# EAGLE schematic rotaryboard-small (EAGLE 6.5.0)
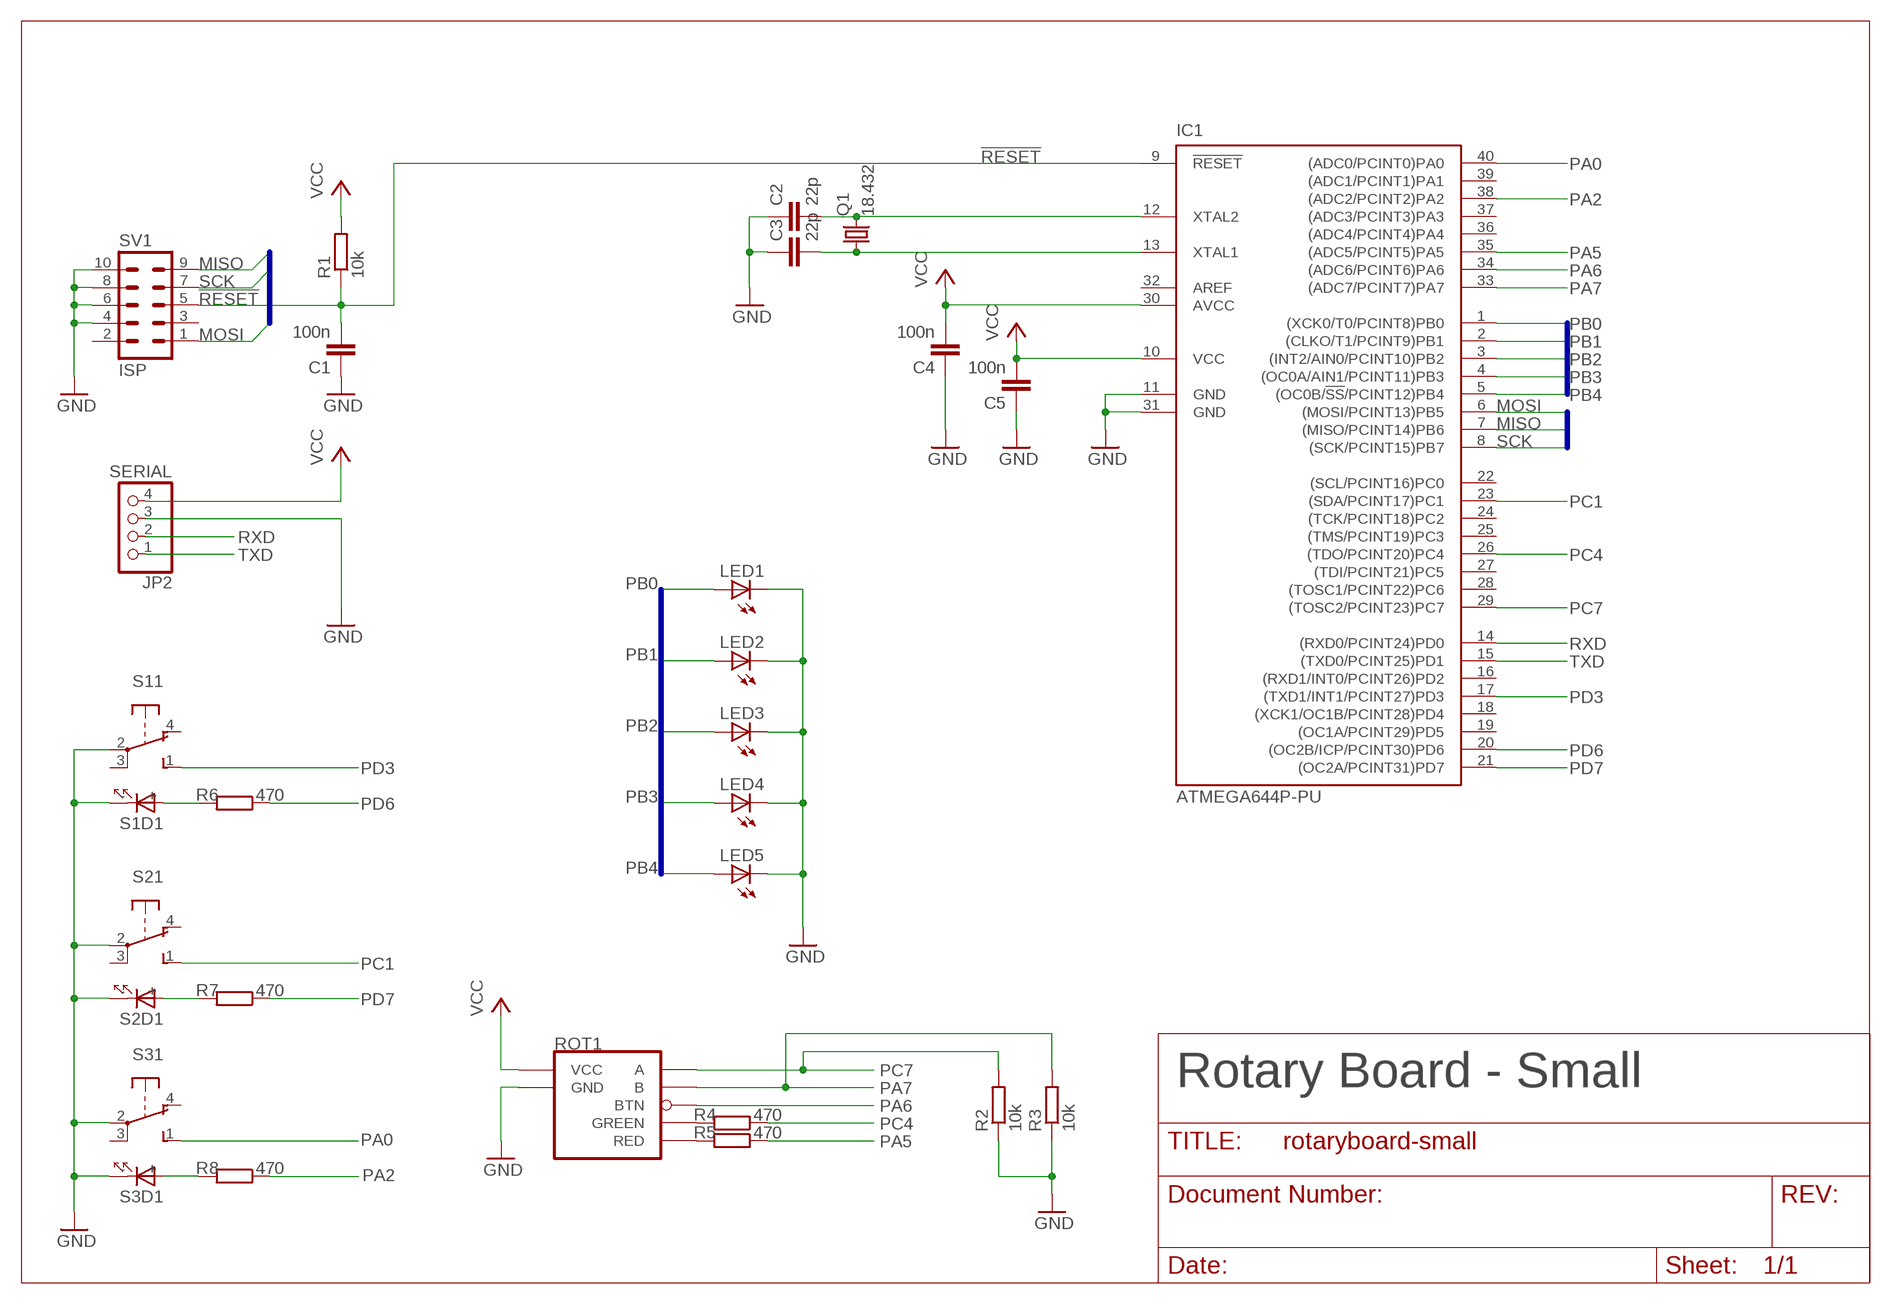
[diagram p0: schematic, sheet 1]

## Parts
C1  100n  C-EU050-025X075  [C050-025X075]
C2  22p  C-EU050-025X075  [C050-025X075]
C3  22p  C-EU050-025X075  [C050-025X075]
C4  100n  C-EU050-025X075  [C050-025X075]
C5  100n  C-EU050-025X075  [C050-025X075]
IC1  ATMEGA644P-PU  MEGA164P/324P/644P-PU  [DIL40]
JP2  SERIAL  PINHD-1X4  [1X04]
LED1  LED3MM  [LED3MM]
LED2  LED3MM  [LED3MM]
LED3  LED3MM  [LED3MM]
LED4  LED3MM  [LED3MM]
LED5  LED3MM  [LED3MM]
Q1  18.432  CRYSTALHC18U-V  [HC18U-V]
R1  10k  R-EU_0207/10  [0207/10]
R2  10k  R-EU_0207/10  [0207/10]
R3  10k  R-EU_0207/10  [0207/10]
R4  470  R-EU_0207/10  [0207/10]
R5  470  R-EU_0207/10  [0207/10]
R6  470  R-EU_0207/10  [0207/10]
R7  470  R-EU_0207/10  [0207/10]
R8  470  R-EU_0207/10  [0207/10]
ROT1  DPL12SVCUSTOM  [DPL12SV]
S1  SRKL  [SRKL]
S2  SRKL  [SRKL]
S3  SRKL  [SRKL]
SV1  ISP  ML10  [ML10]

## Nets
!RESET: C1.2 IC1.9(!RESET) R1.1 SV1.5
GND: C1.1 C2.1 C3.1 C4.1 C5.1 IC1.11(GND) IC1.31(GND) JP2.3 LED1.K(C) LED2.K(C) LED3.K(C) LED4.K(C) LED5.K(C) R2.1 R3.1 ROT1.GND S1.2(1:P) S1.-(D1:C) S2.2(1:P) S2.-(D1:C) S3.2(1:P) S3.-(D1:C) SV1.4 SV1.6 SV1.8 SV1.10
MISO: IC1.7((MISO/PCINT14)PB6) SV1.9
MOSI: IC1.6((MOSI/PCINT13)PB5) SV1.1
N$1: C3.2 IC1.13(XTAL1) Q1.1
N$2: C2.2 IC1.12(XTAL2) Q1.2
N$3: R8.2 S3.+(D1:A)
N$11: R4.2 ROT1.GREEN
N$12: R5.2 ROT1.RED
N$13: R7.2 S2.+(D1:A)
N$14: R6.2 S1.+(D1:A)
PA0: IC1.40((ADC0/PCINT0)PA0) S3.1(1:S)
PA2: IC1.38((ADC2/PCINT2)PA2) R8.1
PA5: IC1.35((ADC5/PCINT5)PA5) R5.1
PA6: IC1.34((ADC6/PCINT6)PA6) ROT1.BTN
PA7: IC1.33((ADC7/PCINT7)PA7) R3.2 ROT1.B
PB0: IC1.1((XCK0/T0/PCINT8)PB0) LED1.A
PB1: IC1.2((CLKO/T1/PCINT9)PB1) LED2.A
PB2: IC1.3((INT2/AIN0/PCINT10)PB2) LED3.A
PB3: IC1.4((OC0A/AIN1/PCINT11)PB3) LED4.A
PB4: IC1.5((OC0B/!SS!/PCINT12)PB4) LED5.A
PC1: IC1.23((SDA/PCINT17)PC1) S2.1(1:S)
PC4: IC1.26((TDO/PCINT20)PC4) R4.1
PC7: IC1.29((TOSC2/PCINT23)PC7) R2.2 ROT1.A
PD3: IC1.17((TXD1/INT1/PCINT27)PD3) S1.1(1:S)
PD6: IC1.20((OC2B/ICP/PCINT30)PD6) R6.1
PD7: IC1.21((OC2A/PCINT31)PD7) R7.1
RXD: IC1.14((RXD0/PCINT24)PD0) JP2.2
SCK: IC1.8((SCK/PCINT15)PB7) SV1.7
TXD: IC1.15((TXD0/PCINT25)PD1) JP2.1
VCC: C4.2 C5.2 IC1.10(VCC) IC1.30(AVCC) JP2.4 R1.2 ROT1.VCC
Unconnected: IC1.16((RXD1/INT0/PCINT26)PD2) IC1.18((XCK1/OC1B/PCINT28)PD4) IC1.19((OC1A/PCINT29)PD5) IC1.22((SCL/PCINT16)PC0) IC1.24((TCK/PCINT18)PC2) IC1.25((TMS/PCINT19)PC3) IC1.27((TDI/PCINT21)PC5) IC1.28((TOSC1/PCINT22)PC6) IC1.36((ADC4/PCINT4)PA4) IC1.37((ADC3/PCINT3)PA3) IC1.39((ADC1/PCINT1)PA1) S1.3(1:P) S1.4(1:O) S2.3(1:P) S2.4(1:O) S3.3(1:P) S3.4(1:O) SV1.2 SV1.3

## Buses
PROG:MOSI,MISO,SCK
LEDS:PB[0..4]

## Notes on the sheet
- Rotary Board - Small

## Power pins joined to a net without a drawn wire
AREF: IC1.32(AREF)

## Library data of the parts
C1-C5 = rcl:C-EU: CAPACITOR, European symbol
IC1 = avr-5:MEGA164P/324P/644P-PU
JP2 = pinhead:PINHD-1X4: PIN HEADER
LED1-LED5 = led:LED: LED OSRAM: - CHIPLED LG R971, LG N971, LY N971, LG Q971, LY Q971, LO R971, LY R971 LH N974, LH R974 LS Q976, LO Q976, LY Q976 LO Q996 - Hyper CHIPLED LW Q18S LB Q993, LB Q99A, LB R99A - SideLED LS A670, LO A670, LY A670, LG A670, LP A670 LB A673, LV A673, LT A673, LW A673 LH A674 LY A675 LS A676, LA A676, LO A676, LY A676, LW A676 LS A679, LY A679, LG A679 - Hyper Micro SIDELED® LS Y876, LA Y876, LO Y876, LY Y876 LT Y87S - SmartLED LW L88C, LW L88S LB L89C, LB L89S, LG L890 LS L89K, LO L89K, LY L89K LS L896, LA L896, LO L896, LY L896 - TOPLED LS T670, LO T670, LY T670, LG T670, LP T670 LSG T670, LSP T670, LSY T670, LOP T670, LYG T670 LG T671, LOG T671, LSG T671 LB T673, LV T673, LT T673, LW T673 LH T674 LS T676, LA T676, LO T676, LY T676, LB T676, LH T676, LSB T676, LW T676 LB T67C, LV T67C, LT T67C, LS T67K, LO T67K, LY T67K, LW E67C LS E67B, LA E67B, LO E67B, LY E67B, LB E67C, LV E67C, LT E67C LW T67C LS T679, LY T679, LG T679 LS T770, LO T770, LY T770, LG T770, LP T770 LB T773, LV T773, LT T773, LW T773 LH T774 LS E675, LA E675, LY E675, LS T675 LS T776, LA T776, LO T776, LY T776, LB T776 LHGB T686 LT T68C, LB T68C - Hyper Mini TOPLED® LB M676 - Mini TOPLED Santana® LG M470 LS M47K, LO M47K, LY M47K Source: http://www.osram.convergy.de LUXEON: - LUMILED® LXK2-PW12-R00, LXK2-PW12-S00, LXK2-PW14-U00, LXK2-PW14-V00 LXK2-PM12-R00, LXK2-PM12-S00, LXK2-PM14-U00 LXK2-PE12-Q00, LXK2-PE12-R00, LXK2-PE12-S00, LXK2-PE14-T00, LXK2-PE14-U00 LXK2-PB12-K00, LXK2-PB12-L00, LXK2-PB12-M00, LXK2-PB14-N00, LXK2-PB14-P00, LXK2-PB14-Q00 LXK2-PR12-L00, LXK2-PR12-M00, LXK2-PR14-Q00, LXK2-PR14-R00 LXK2-PD12-Q00, LXK2-PD12-R00, LXK2-PD12-S00 LXK2-PH12-R00, LXK2-PH12-S00 LXK2-PL12-P00, LXK2-PL12-Q00, LXK2-PL12-R00 Source: www.luxeon.com KINGBRIGHT: KA-3528ASYC Source: www.kingbright.com
Q1 = crystal:CRYSTAL: CRYSTAL; OC_FARNELL: unknown; OC_NEWARK: unknown
R1-R8 = rcl:R-EU_: RESISTOR, European symbol
ROT1 = rotary:DPL12SV: DPL12S rotary encoder with switch and dual-color LED
S1-S3 = switch-misc:SRKL: SWITCH
SV1 = con-harting-ml:ML10: HARTING; OC_FARNELL: unknown; OC_NEWARK: unknown